# EAGLE schematic 120V Inverter Power Supply (EAGLE 6.2)
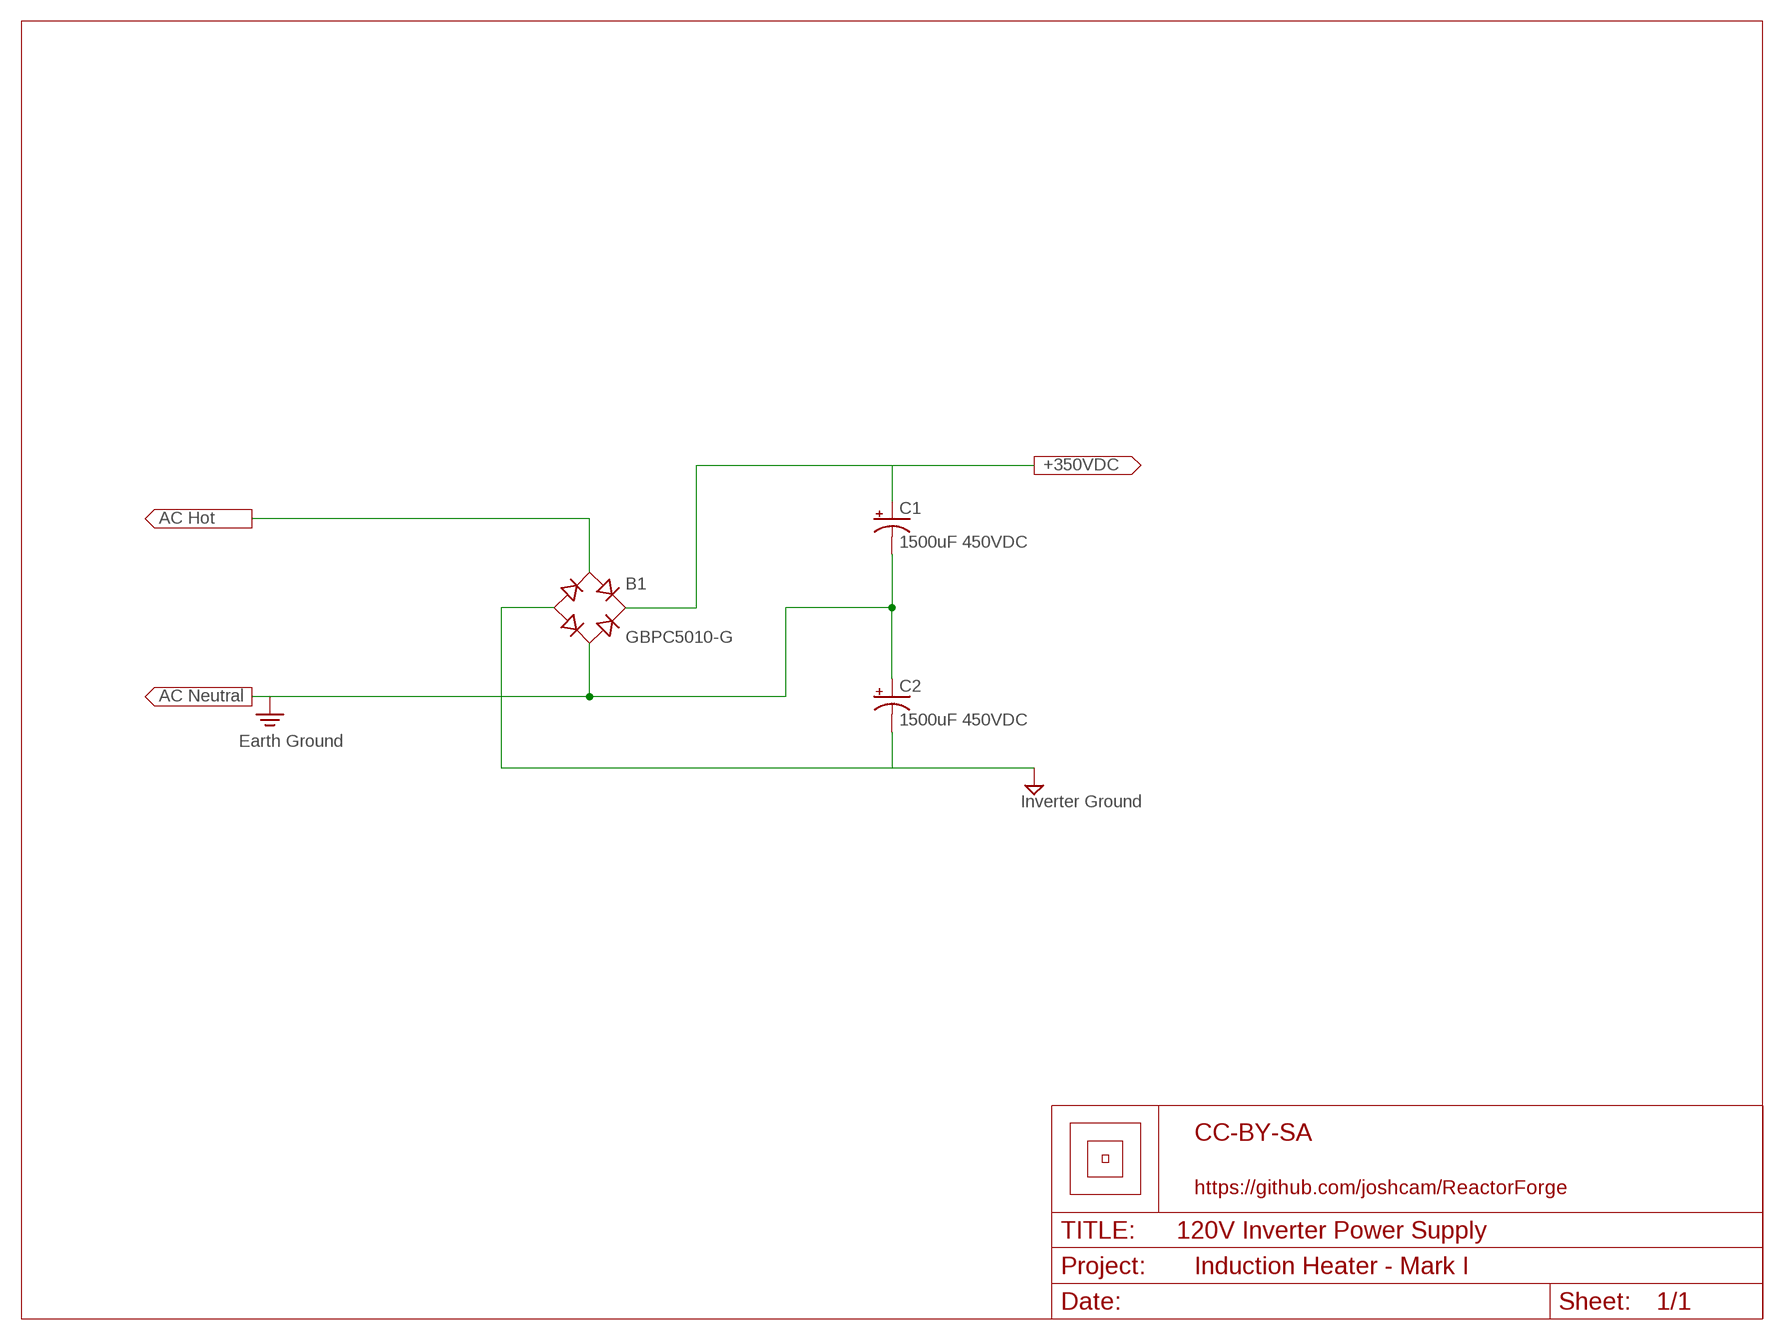
[diagram p0: schematic, sheet 1]
U$1 (LETTER_L): LICENSE: CC-BY-SA; PROJECT: Induction Heater - Mark I; URL: https://github.com/joshcam/ReactorForge

## Parts
B1  GBPC5010-G  DBDB101G  [DB]
C1  1500uF 450VDC  CPOL-USE10-35  [EB35D]
C2  1500uF 450VDC  CPOL-USE10-35  [EB35D]

## Nets
GND: B1.- C2.- ; supply symbol labelled Inverter Ground
N$1: B1.+ C1.+
N$4: B1.AC1
PE: B1.AC2 C1.- C2.+ ; supply symbol labelled Earth Ground

## Library data of the parts
B1 = rectifier:DB?*G: Single Phase 1.0 AMP Glass Passivated Bridge Rectifier Taiwan Semiconductor Co.,Ltd. - TSC Source: http://www.taiwansemi.com/TSCbig5/ezcatfiles/cust/img/img/db101g.pdf http://www.ts.com.tw/db/pictures/modules/PDT/PDT060207001/DBLS201G.pdf
C1 C2 = rcl:CPOL-US: POLARIZED CAPACITOR, American symbol